# EAGLE design hex-motor-controler (EAGLE 6.5.0)
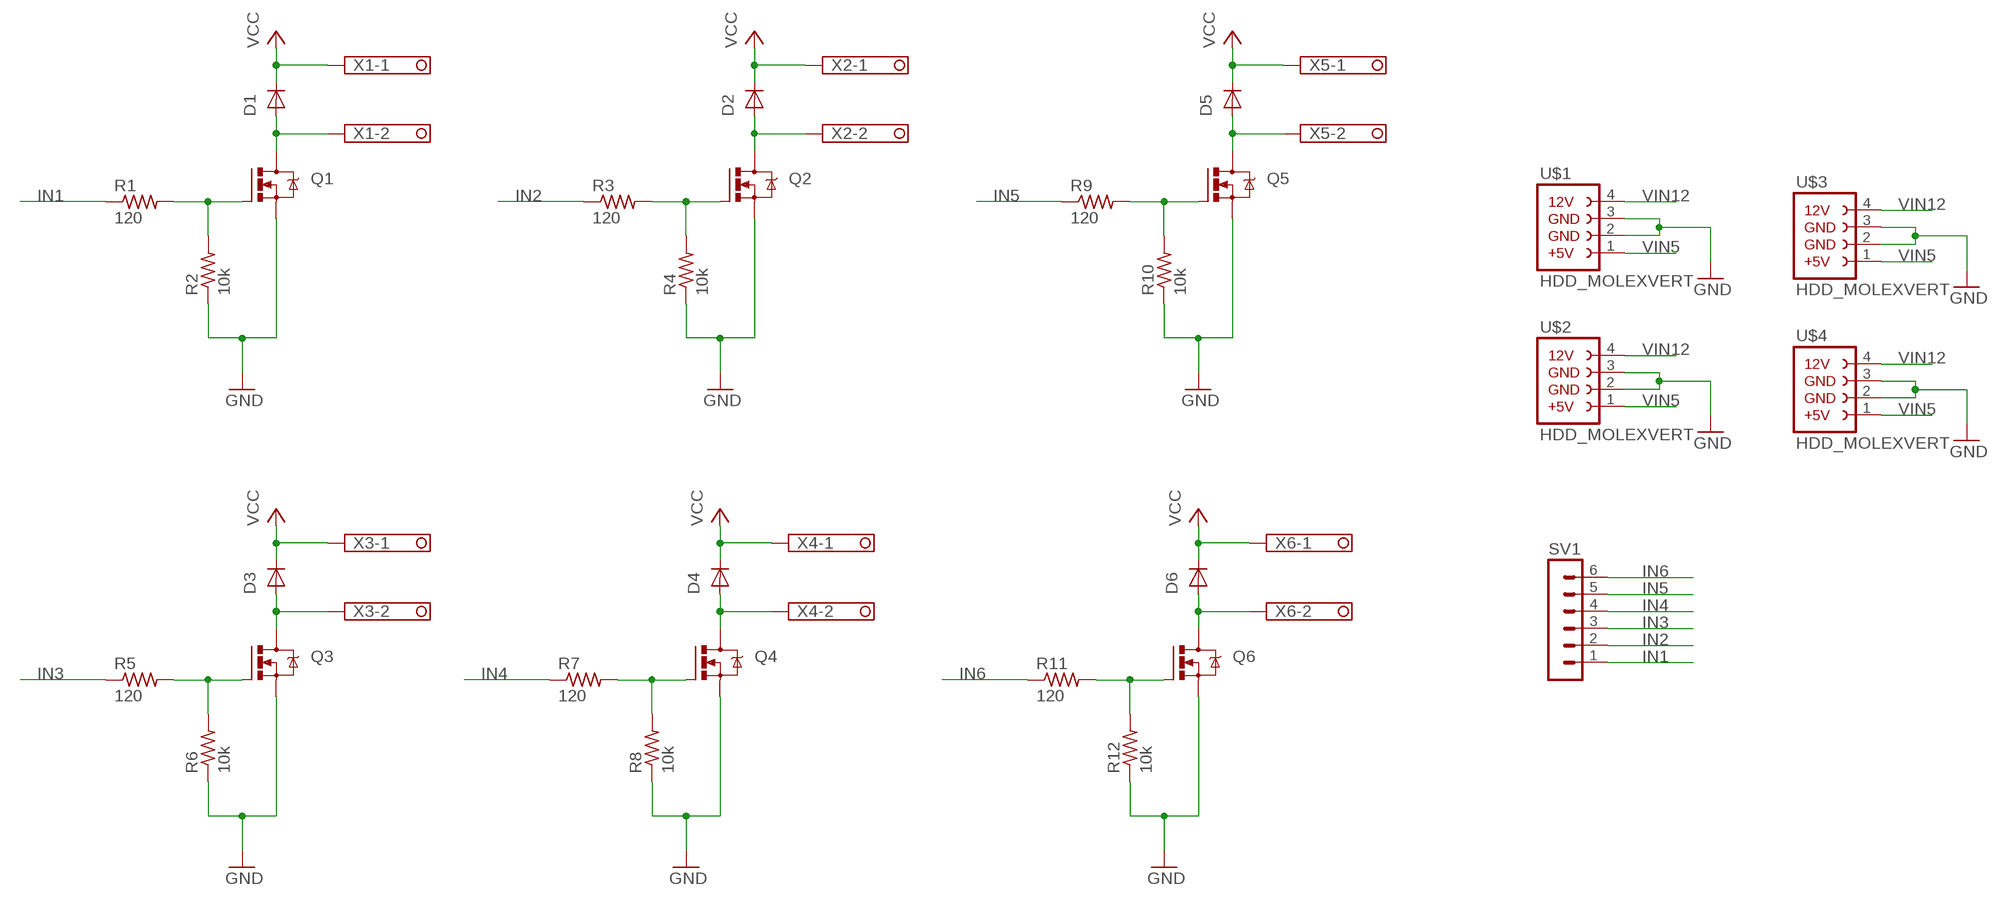
[diagram p0: schematic, sheet 1]

## Parts
D1  1N4004  [DO41-10]
D2  1N4004  [DO41-10]
D3  1N4004  [DO41-10]
D4  1N4004  [DO41-10]
D5  1N4004  [DO41-10]
D6  1N4004  [DO41-10]
Q1  IRF530  [TO220BV]
Q2  IRF530  [TO220BV]
Q3  IRF530  [TO220BV]
Q4  IRF530  [TO220BV]
Q5  IRF530  [TO220BV]
Q6  IRF530  [TO220BV]
R1  120  R-US_0207/7  [0207/7]
R2  10k  R-US_0207/7  [0207/7]
R3  120  R-US_0207/7  [0207/7]
R4  10k  R-US_0207/7  [0207/7]
R5  120  R-US_0207/7  [0207/7]
R6  10k  R-US_0207/7  [0207/7]
R7  120  R-US_0207/7  [0207/7]
R8  10k  R-US_0207/7  [0207/7]
R9  120  R-US_0207/7  [0207/7]
R10  10k  R-US_0207/7  [0207/7]
R11  120  R-US_0207/7  [0207/7]
R12  10k  R-US_0207/7  [0207/7]
SV1  MA06-1  [MA06-1]
U$1  HDD_MOLEXVERT  [HDD_MOLEX_VERT]
U$2  HDD_MOLEXVERT  [HDD_MOLEX_VERT]
U$3  HDD_MOLEXVERT  [HDD_MOLEX_VERT]
U$4  HDD_MOLEXVERT  [HDD_MOLEX_VERT]
X1  1751248  [1751248]
X2  1751248  [1751248]
X3  1751248  [1751248]
X4  1751248  [1751248]
X5  1751248  [1751248]
X6  1751248  [1751248]

## Nets
GND: Q1.S Q2.S Q3.S Q4.S Q5.S Q6.S R2.1 R4.1 R6.1 R8.1 R10.1 R12.1 U$1.2 U$1.3 U$2.2 U$2.3 U$3.2 U$3.3 U$4.2 U$4.3
IN1: R1.1 SV1.1
IN2: R3.1 SV1.2
IN3: R5.1 SV1.3
IN4: R7.1 SV1.4
IN5: R9.1 SV1.5
IN6: R11.1 SV1.6
N$1: Q1.G R1.2 R2.2
N$2: Q2.G R3.2 R4.2
N$3: D2.A Q2.D X2.2
N$4: D1.A Q1.D X1.2
N$5: Q3.G R5.2 R6.2
N$6: D3.A Q3.D X3.2
N$7: Q4.G R7.2 R8.2
N$8: D4.A Q4.D X4.2
N$9: Q5.G R9.2 R10.2
N$10: D5.A Q5.D X5.2
N$11: Q6.G R11.2 R12.2
N$12: D6.A Q6.D X6.2
VCC: D1.C D2.C D3.C D4.C D5.C D6.C X1.1 X2.1 X3.1 X4.1 X5.1 X6.1
VIN5: U$1.1 U$2.1 U$3.1 U$4.1
VIN12: U$1.4 U$2.4 U$3.4 U$4.4

## Library data of the parts
D1-D6 = diode:1N4004: DIODE general purpose rectifier, 1 A
Q1-Q6 = transistor-power:IRF530: HEXFET Power MOSFET
R1-R12 = rcl:R-US_: RESISTOR, American symbol
SV1 = con-lstb:MA06-1: PIN HEADER; OC_FARNELL: unknown; OC_NEWARK: unknown
U$1-U$4 = my_lib:HDD_MOLEX
X1-X6 = con-phoenix-350:1751248: MKDS 1/ 2-3,5 Printklemme Nennstrom: 10 A Bemessungsspannung: 160 V Raster: 3,5 mm Polzahl: 2 Montageart: Löten Anschlussart: Schraubanschluss Anschlussrichtung vom Leiter zur Platine: 0° Source: http://eshop.phoenixcontact.com .. 1751248.pdf; OC_FARNELL: unknown; OC_NEWARK: unknown

## Board
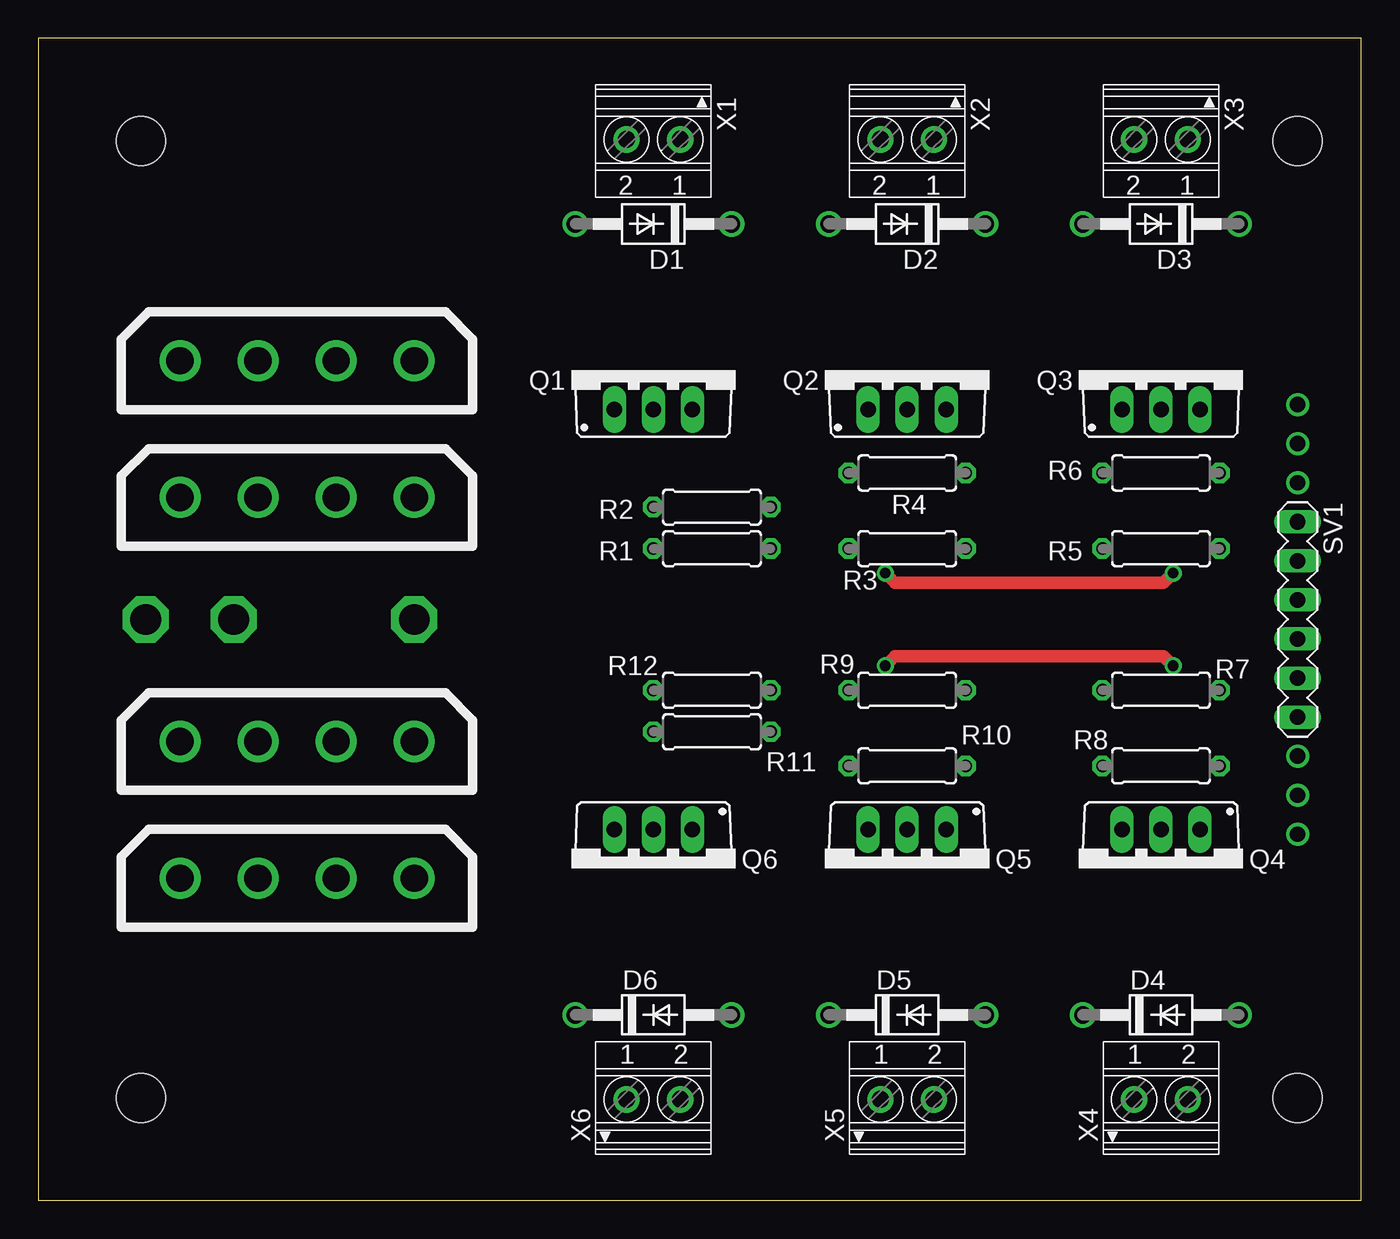
[diagram p1: board, top side]
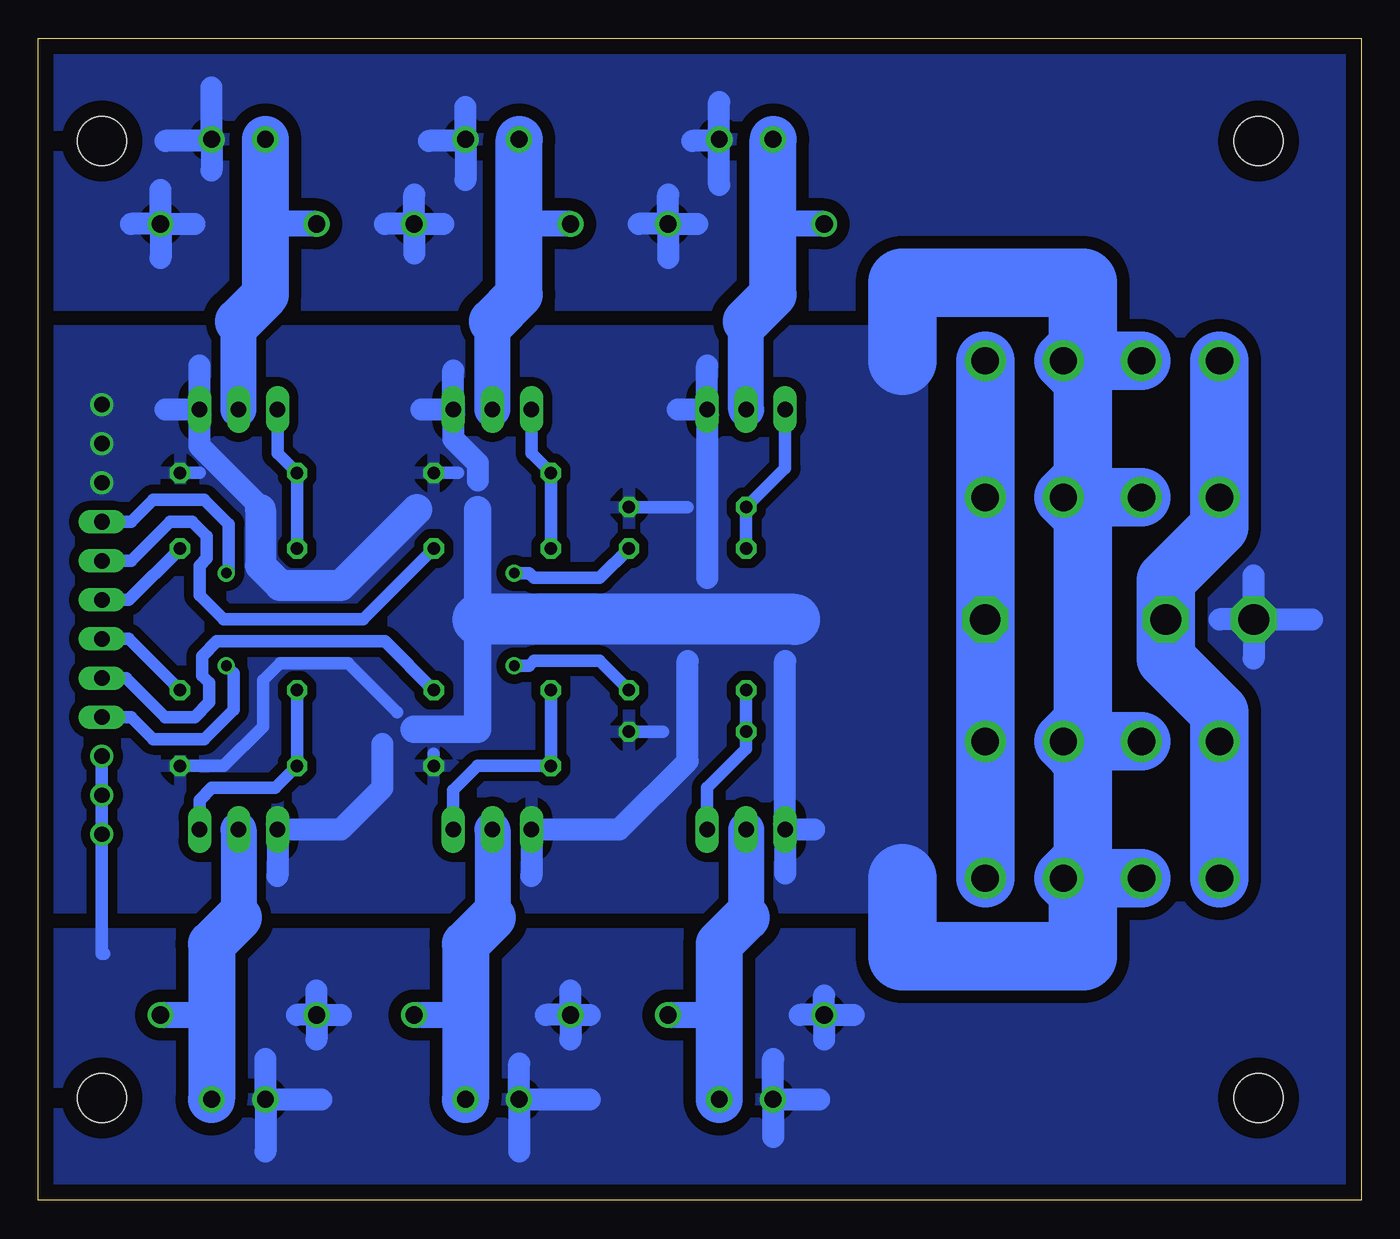
[diagram p2: board, bottom side, seen from below]

Size 86.04 x 75.56 mm. Coordinates in mm from the lower left corner, seen from the top.
Outline: 0,0 86.04,0 86.04,75.56 0,75.56 0,0
Copper layers (1*16): Top 0.035mm / dielectric 1.5mm / Bottom 0.035mm
Design rules "default *": minimum track width 32mil, minimum drill 24mil, track to track 24mil, track to pad 24mil, pad to pad 24mil, via to via 24mil, smd to smd 8mil, copper to edge 40mil, drill to drill 8mil, minimum pad ring 10mil, minimum via ring 8mil, stop-mask expansion 4mil, vias tented up to drill 0mil, thermal gap 24mil
Holes 3.2 mm at 6.67,68.9 81.92,68.9 81.92,6.67 6.67,6.67

### Footprints (pad centres in the part's own frame; a part is rotated, then mirrored left to right if it is on the bottom)
DO41-10 = drill 1.118: A 5.08,0; C -5.08,0
TO220BV = drill 1.016 long: D 0,-2.54; G -2.54,-2.54; S 2.54,-2.54
0207/7 = drill 0.813 octagon: 1 -3.81,0; 2 3.81,0
MA06-1 = drill 1.016 long: 1 -6.35,0; 2 -3.81,0; 3 -1.27,0; 4 1.27,0; 5 3.81,0; 6 6.35,0
HDD_MOLEX_VERT = drill 1.778: 1 -7.62,0; 2 -2.54,0; 3 2.54,0; 4 7.62,0
1751248 = drill 1.1 pad 1.7: 1 -1.75,-0.1; 2 1.75,-0.1

### Placement (x,y rotation side)
D1  40.01,63.5 180 top
D2  56.52,63.5 180 top
D3  73.03,63.5 180 top
D4  73.03,12.06 0 top
D5  56.52,12.06 0 top
D6  40.01,12.06 0 top
Q1  40.01,53.98 0 top
Q2  56.52,53.98 0 top
Q3  73.03,53.98 0 top
Q4  73.03,21.59 180 top
Q5  56.52,21.59 180 top
Q6  40.01,21.59 180 top
R1  43.81,42.39 180 top
R2  43.81,45.09 180 top
R3  56.52,42.39 180 top
R4  56.52,47.31 180 top
R5  73.03,42.39 180 top
R6  73.03,47.31 180 top
R7  73.03,33.18 180 top
R8  73.03,28.26 180 top
R9  56.52,33.18 180 top
R10  56.52,28.26 180 top
R11  43.81,33.18 180 top
R12  43.81,30.48 180 top
SV1  81.92,37.78 270 top
U$1  16.83,54.61 180 top
U$2  16.83,45.72 180 top
U$3  16.83,29.84 180 top
U$4  16.83,20.95 180 top
X1  40.01,68.9 180 top
X2  56.52,68.9 180 top
X3  73.03,68.9 180 top
X4  73.03,6.67 0 top
X5  56.52,6.67 0 top
X6  40.01,6.67 0 top

### Tracks (layer width: path | path; a pad name or v marks a point on that pad's centre or on a via)
GND  (via drill 1)
  Bottom 0.813: R10.1 60.33,29.05 | R4.1 58.74,47.31 | R8.1 73.98,28.26 71.44,30.8 71.44,33.81 70.33,34.92 65.88,34.92 62.71,31.75 | R6.1 75.56,47.31 | R2.1 43.81,45.09 | R12.1 45.4,30.48
  Bottom 1.422: Q6.S 37.47,35.08 | Q1.S 42.55,40.48 | 43.81,35.08 43.81,28.57 48.26,24.13 Q5.S 53.98,21.11 | 63.66,29.69 63.66,26.83 66.36,24.13 Q4.S 70.48,21.11 | Q2.S 59.05,49.53 57.47,47.94 57.47,46.83 | 71.6,44.93 71.6,45.09 75.56,49.05 Q3.S | Q1.S 42.55,54.29 | Q1.S 44.45,51.44 | Q2.S 59.05,53.98 | Q2.S 61.12,51.44 | Q3.S 75.56,54.29 | Q3.S 77.79,51.44 | Q6.S 37.47,21.27 | Q6.S 35.56,24.13
  Bottom 1.778: 61.59,30.64 57.47,30.64 57.47,37.78 57.47,44.93
  Bottom 2.032: 71.6,44.93 71.6,41.27 70.33,40.01 66.36,40.01 61.44,44.93
  Bottom 3.302: 36.83,37.78 57.47,37.78
  Bottom 3.81: U$2.3 U$2.2 | U$3.3 U$3.2 | U$4.3 U$4.2 | U$2.2 18.1,44.45 18.1,31.11 U$3.2 | U$3.2 18.1,28.57 18.1,22.23 U$4.2 | U$1.3 U$1.2 | U$1.2 18.1,53.34 18.1,46.99 U$2.2 | U$4.2 18.1,19.68 | U$1.2 18.1,55.88
  Bottom 4.445: 18.1,19.68 18.1,15.88 29.84,15.88 29.84,20.95 | 18.1,55.88 18.1,59.69 29.84,59.69 29.84,54.61
  other vias: 81.92,49.21 81.92,46.67 81.92,51.75
  pour Bottom (isolate 0.61): 86.04,19.05 28.57,19.05 28.57,56.52 86.04,56.52
IN1  (via drill 0.7)
  Top 0.813: v55.09,40.8 55.72,40.16 73.18,40.16 v73.82,40.8
  Bottom 0.813: SV1.1 80.01,44.13 78.58,45.56 75.25,45.56 73.66,43.97 73.66,40.96 v73.82,40.8 | v55.09,40.8 54.13,40.8 53.82,40.48 49.53,40.48 R1.1
IN2
  Bottom 0.813: SV1.2 80.01,41.59 77.47,44.13 76.04,44.13 75.09,43.18 75.09,41.75 75.56,41.27 75.56,39.37 73.98,37.78 64.93,37.78 R3.1
IN3
  Bottom 0.813: R5.1 80.17,39.05 SV1.3
IN4
  Bottom 0.813: R7.1 80.17,36.51 SV1.4
IN5
  Bottom 0.813: SV1.5 80.33,33.97 77.79,31.43 75.88,31.43 74.93,32.38 74.93,33.66 75.41,34.13 75.41,35.4 74.45,36.35 63.5,36.35 R9.1
IN6  (via drill 0.7)
  Top 0.813: v55.09,34.77 55.72,35.4 73.18,35.4 v73.82,34.77
  Bottom 0.813: SV1.6 80.01,31.43 78.58,30 75.25,30 73.34,31.91 73.34,34.29 v73.82,34.77 | v55.09,34.77 54.13,34.77 53.82,35.08 49.53,35.08 R11.1
N$1
  Bottom 0.813: R1.2 R2.2 37.47,47.62 Q1.G
N$2
  Bottom 0.813: R3.2 R4.2 53.98,48.58 Q2.G
N$3
  Bottom 1.676: D2.A 54.77,63.5
  Bottom 2.337: Q2.D 56.52,57.15
  Bottom 3.048: 56.52,57.15 54.77,58.9 54.77,63.5 X2.2
N$4
  Bottom 1.676: D1.A 38.26,63.5
  Bottom 2.337: Q1.D 40.01,57.15
  Bottom 3.048: 40.01,57.15 38.26,58.9 38.26,63.5 X1.2
N$5
  Bottom 0.813: R5.2 R6.2 70.48,48.58 Q3.G
N$6
  Bottom 1.676: D3.A 71.28,63.5
  Bottom 2.337: Q3.D 73.03,57.15
  Bottom 3.048: 73.03,57.15 71.28,58.9 71.28,63.5 X3.2
N$7
  Bottom 0.813: R7.2 R8.2 70.64,26.83 74.77,26.83 75.56,26.04 Q4.G
N$8
  Bottom 1.676: D4.A 74.78,12.06
  Bottom 2.337: Q4.D 73.03,18.41
  Bottom 3.048: 73.03,18.41 74.78,16.66 74.78,12.06 X4.2
N$9
  Bottom 0.813: R9.2 R10.2 57.47,28.26 59.05,26.67 Q5.G
N$10
  Bottom 1.676: D5.A 58.27,12.06
  Bottom 2.337: Q5.D 56.52,18.41
  Bottom 3.048: 56.52,18.41 58.27,16.66 58.27,12.06 X5.2
N$11
  Bottom 0.813: Q6.G 42.55,26.83 40.01,29.37 R12.2 R11.2
N$12
  Bottom 1.676: D6.A 41.76,12.06
  Bottom 2.337: Q6.D 40.01,18.41
  Bottom 3.048: 40.01,18.41 41.76,16.66 41.76,12.06 X6.2
VCC  (via drill 1, 2)
  Bottom 0.813: v81.92,28.89 v81.92,26.35 v81.92,23.81 81.92,16.03 81.76,16.03
  Bottom 1.422: X1.1 41.76,71.44 | X1.1 41.76,68.9 43.5,68.9 | 41.76,66.04 X1.1 | D1.C 45.09,65.41 | D1.C 45.09,61.28 | D1.C 46.99,63.5 | D1.C 43.18,63.5 | D2.C 63.5,63.5 | D2.C 59.69,63.5 | D2.C 61.59,65.41 | D2.C 61.59,61.59 | D3.C 78.11,65.72 | D3.C 80.01,63.5 | D3.C 75.88,63.5 | D3.C 78.11,61.28 | 58.27,71.12 X2.1 58.27,68.9 | 58.27,68.9 60.64,68.9 | 58.27,68.9 58.27,66.36 | 74.78,72.39 X3.1 74.78,68.9 | 74.78,68.9 77.79,68.9 | 74.78,68.9 74.78,66.99 | v6.99,37.78 3.17,37.78 | v6.99,37.78 6.99,40.64 | v6.99,37.78 9.21,37.78 | v6.99,37.78 6.99,35.24 | D6.C 36.51,12.06 | D6.C 33.02,12.06 | D6.C 34.92,10.48 | D6.C 34.92,13.34 | D5.C 53.02,12.06 | D5.C 50.16,12.06 | D5.C 51.44,13.65 | D5.C 51.44,10.48 | D4.C 67.94,13.65 | D4.C 67.94,10.48 | D4.C 69.22,12.06 | D4.C 66.36,12.06 | X6.1 35.24,6.57 | X6.1 38.26,4.13 | X6.1 38.26,9.21 | X5.1 54.77,3.17 | X5.1 50.16,6.57 | X5.1 54.77,8.89 | X4.1 71.28,3.17 | X4.1 67.63,6.57 | X4.1 71.28,9.21
  pour Bottom (isolate 0.813): 0,0 86.04,0 86.04,17.3 15.56,17.3 15.56,58.26 86.04,58.26 86.04,75.56 0,75.56
VIN5  (via drill 2)
  Bottom 3.81: U$4.1 U$3.1 v24.45,37.78 U$2.1 U$1.1
VIN12  (via drill 2)
  Bottom 3.81: U$1.4 U$2.4 9.21,43.81 12.7,40.32 v12.7,37.78 12.7,35.24 9.21,31.75 U$3.4 U$4.4

### Text on the board
Document: 1 | 2 | 3 | +12V | GND | GND | +5V | GND | 1 | 2 | . | C | 12 | 5 | . | . | 5 | 6 | VCC | * 'C' desconectado / -> OFF / * 'C' ligado a '5' / -> VCC = +5V / * 'C' ligado a '12' / -> VCC = +12V / / * VCC = tensao nos motores / * Para ligar 'C' a '5' ou a '12', / usar um fio o mais / grosso possivel. | 6 | 5 | 4